# EAGLE schematic cRIO Breakout (EAGLE 5.11)
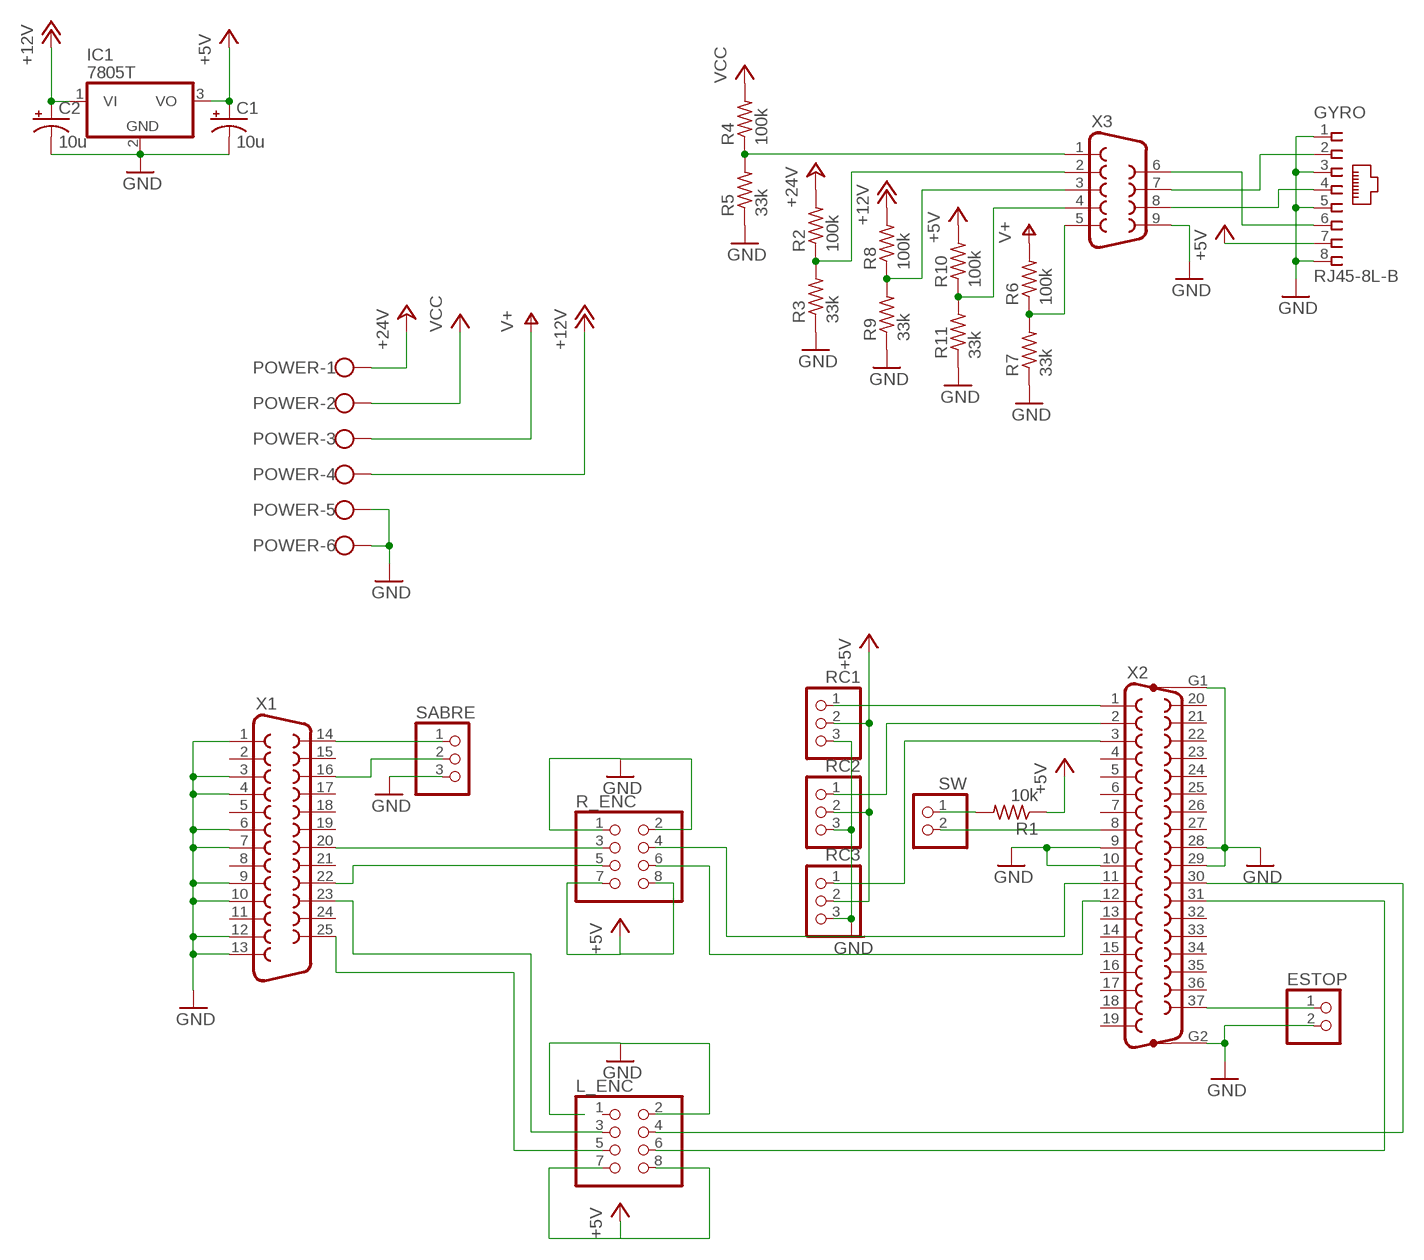
[diagram p0: schematic, sheet 1]

## Parts
C1  10u  CPOL-USE2-5  [E2-5]
C2  10u  CPOL-USE2-5  [E2-5]
ESTOP  PINHD-1X2  [1X02]
GYRO  RJ45-8L-B  [RJ45-NO-SHIELD]
IC1  7805T  [TO220H]
L_ENC  PINHD-2X4/90  [2X04/90]
POWER  W237-6  [W237-6]
R1  10k  R-US_0207/10  [0207/10]
R2  100k  R-US_0207/10  [0207/10]
R3  33k  R-US_0207/10  [0207/10]
R4  100k  R-US_0207/10  [0207/10]
R5  33k  R-US_0207/10  [0207/10]
R6  100k  R-US_0207/10  [0207/10]
R7  33k  R-US_0207/10  [0207/10]
R8  100k  R-US_0207/10  [0207/10]
R9  33k  R-US_0207/10  [0207/10]
R10  100k  R-US_0207/10  [0207/10]
R11  33k  R-US_0207/10  [0207/10]
R_ENC  PINHD-2X4/90  [2X04/90]
RC1  PINHD-1X3  [1X03]
RC2  PINHD-1X3  [1X03]
RC3  PINHD-1X3  [1X03]
SABRE  PINHD-1X3  [1X03]
SW  PINHD-1X2  [1X02]
X1  F25V  [F25V]
X2  F37VP  [F37VP]
X3  F09H  [F09H]

## Nets
+5V: C1.+ GYRO.7 IC1.3(VO) L_ENC.7 L_ENC.8 R1.1 R10.2 R_ENC.7 R_ENC.8 RC1.2 RC2.2 RC3.2
+12V: C2.+ IC1.1(VI) POWER.4 R8.2
+24V: POWER.1 R2.2
GND: C1.- C2.- ESTOP.2 GYRO.1 GYRO.3 GYRO.5 GYRO.8 IC1.2(GND) L_ENC.2 POWER.5 POWER.6 R3.1 R5.1 R7.1 R9.1 R11.1 R_ENC.1 R_ENC.2 RC1.3 RC2.3 RC3.3 SABRE.3 X1.1 X1.3 X1.4 X1.6 X1.7 X1.9 X1.10 X1.12 X1.13 X2.9 X2.10 X2.28 X2.29 X2.G1 X2.G2 X3.9
N$1: RC1.1 X2.1
N$2: RC2.1 X2.2
N$3: RC3.1 X2.3
N$4: SW.2 X2.8
N$5: R1.2 SW.1
N$7: L_ENC.4 X2.30
N$8: L_ENC.6 X2.31
N$9: ESTOP.1 X2.37
N$10: R_ENC.4 X2.11
N$11: SABRE.1 X1.14
N$12: SABRE.2 X1.16
N$14: R_ENC.5 X1.22
N$15: R6.1 R7.2 X3.5
N$16: GYRO.6 X3.6
N$17: L_ENC.3 X1.23
N$18: L_ENC.5 X1.25
N$19: GYRO.2 X3.7
N$20: R2.1 R3.2 X3.2
N$21: R4.1 R5.2 X3.1
N$22: R_ENC.3 X1.20
N$23: GYRO.4 X3.8
N$24: R10.1 R11.2 X3.4
N$25: R_ENC.6 X2.12
N$26: R8.1 R9.2 X3.3
V+: POWER.3 R6.2
VCC: POWER.2 R4.2
Unconnected: L_ENC.1 X1.2 X1.5 X1.8 X1.11 X1.15 X1.17 X1.18 X1.19 X1.21 X1.24 X2.4 X2.5 X2.6 X2.7 X2.13 X2.14 X2.15 X2.16 X2.17 X2.18 X2.19 X2.20 X2.21 X2.22 X2.23 X2.24 X2.25 X2.26 X2.27 X2.32 X2.33 X2.34 X2.35 X2.36

## Library data of the parts
C1 C2 = resistor:CPOL-US: POLARIZED CAPACITOR, American symbol
ESTOP SW = pinhead:PINHD-1X2: PIN HEADER
GYRO = con-tycoelectronics:RJ45: CORCOM Modular RJ Jacks No Shield Source: www.tycoelectronics.com .. ENG_DS_1654001_1099_RJ_L_0507.pdf; MF: TYCO ELECTRONICS; MPN: RJ45-8L-B; OC_FARNELL: 1279843; OC_NEWARK: 52K4445
IC1 = linear:78*: Positive VOLTAGE REGULATOR Source: http://cache.national.com/ds/LM/LM78L05.pdf http://www.fairchildsemi.com/ds/LM/LM7805.pdf
L_ENC R_ENC = pinhead:PINHD-2X4: PIN HEADER
POWER = con-wago-500:W237-6: WAGO SCREW CLAMP; OC_FARNELL: unknown; OC_NEWARK: unknown
R1-R11 = resistor:R-US_: RESISTOR, American symbol
RC1-RC3 SABRE = pinhead:PINHD-1X3: PIN HEADER
X1 = con-subd:F25: SUB-D; OC_FARNELL: unknown; OC_NEWARK: unknown
X2 = con-subd:F37VP: SUB-D; OC_FARNELL: unknown; OC_NEWARK: unknown
X3 = con-subd:F09: SUB-D; OC_FARNELL: unknown; OC_NEWARK: unknown